# Altium schematic sheet USB Isolator.SchDoc: USB Isolator
size A4; SheetNumber: 1; SheetTotal: 1
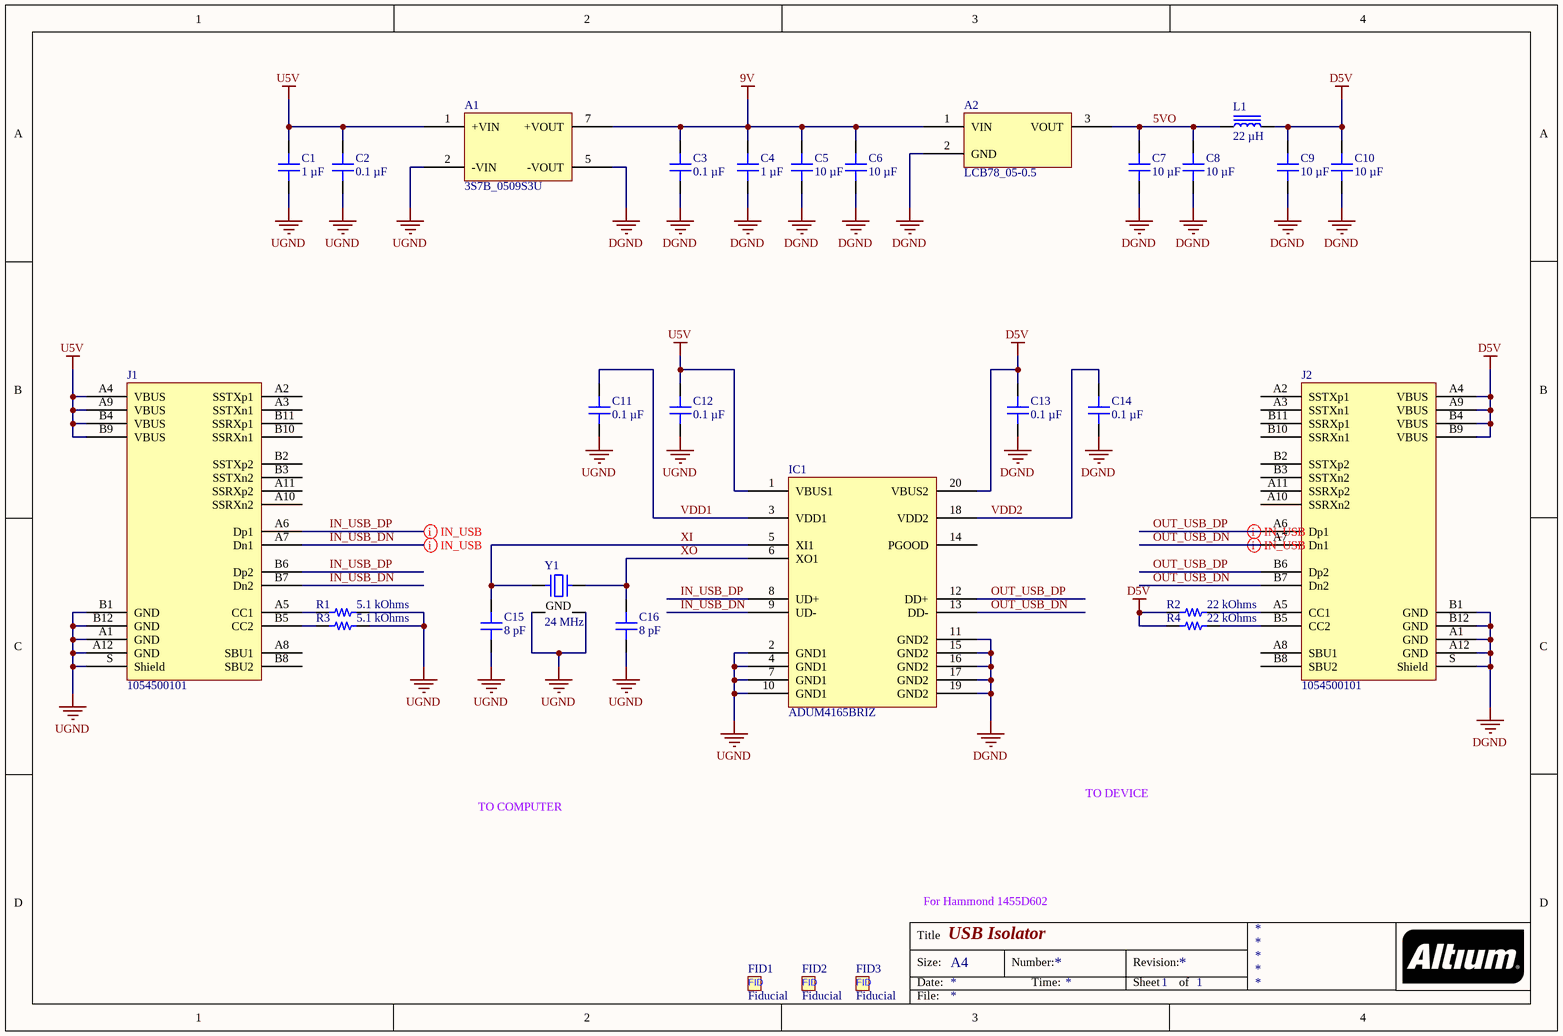
[diagram p0: USB Isolator.SchDoc]

## Parts
A1  3S7B_0509S3U  [GAPTEC 3S7B_3U SINGLE]
A2  LCB78_05-0.5  [GAPTEC LCB78_0.5]
C1  1 µF  [CAP 0603_1608]
C2  0.1 µF  [CAP 0603_1608]
C3  0.1 µF  [CAP 0603_1608]
C4  1 µF  [CAP 0603_1608]
C5  10 µF  [CAP 1206_3216 - 0.8MM]
C6  10 µF  [CAP 1206_3216 - 0.8MM]
C7  10 µF  [CAP 1206_3216 - 0.8MM]
C8  10 µF  [CAP 1206_3216 - 0.8MM]
C9  10 µF  [CAP 1206_3216 - 0.8MM]
C10  10 µF  [CAP 1206_3216 - 0.8MM]
C11  0.1 µF  [CAP 0603_1608]
C12  0.1 µF  [CAP 0603_1608]
C13  0.1 µF  [CAP 0603_1608]
C14  0.1 µF  [CAP 0603_1608]
C15  8 pF  [CAP 0603_1608]
C16  8 pF  [CAP 0603_1608]
FID1  Fiducial  [Fiducial-1mm]  (no BOM)
FID2  Fiducial  [Fiducial-1mm]  (no BOM)
FID3  Fiducial  [Fiducial-1mm]  (no BOM)
IC1  ADUM4165BRIZ  [ANALOG SOIC-20 RI-20-1]
J1  1054500101  [Molex 1054500101]
J2  1054500101  [Molex 1054500101]
L1  22 µH  [TDK VLCF4028-2]
R1  5.1 kOhms  [RES 0603_1608]
R2  22 kOhms  [RES 0603_1608]
R3  5.1 kOhms  [RES 0603_1608]
R4  22 kOhms  [RES 0603_1608]
Y1  24 MHz  [NDK NX2520SA]

## Nets
9V: A1.7(+VOUT) A2.1(VIN) C3.2 C4.2 C5.2 C6.2
D5V: C9.2 C10.2 C13.2 IC1.20(VBUS2) J2.A4(VBUS) J2.A9(VBUS) J2.B4(VBUS) J2.B9(VBUS) L1.2 R2.1 R4.1
DGND: A1.5(-VOUT) A2.2(GND) C3.1 C4.1 C5.1 C6.1 C7.1 C8.1 C9.1 C10.1 C13.1 C14.1 IC1.11(GND2) IC1.15(GND2) IC1.16(GND2) IC1.17(GND2) IC1.19(GND2) J2.A1(GND) J2.A12(GND) J2.B1(GND) J2.B12(GND) J2.S(Shield)
U5V: A1.1(+VIN) C1.2 C2.2 C12.2 IC1.1(VBUS1) J1.A4(VBUS) J1.A9(VBUS) J1.B4(VBUS) J1.B9(VBUS)
UGND: A1.2(-VIN) C1.1 C2.1 C11.1 C12.1 C15.1 C16.1 IC1.2(GND1) IC1.4(GND1) IC1.7(GND1) IC1.10(GND1) J1.A1(GND) J1.A12(GND) J1.B1(GND) J1.B12(GND) J1.S(Shield) R1.1 R3.1 Y1.2(GND) Y1.4(GND)
5VO: A2.3(VOUT) C7.2 C8.2 L1.1
IN_USB_DN: IC1.9(UD-) J1.A7(Dn1) J1.B7(Dn2)
IN_USB_DP: IC1.8(UD+) J1.A6(Dp1) J1.B6(Dp2)
OUT_USB_DN: IC1.13(DD-) J2.A7(Dn1) J2.B7(Dn2)
OUT_USB_DP: IC1.12(DD+) J2.A6(Dp1) J2.B6(Dp2)
VDD1: C11.2 IC1.3(VDD1)
VDD2: C14.2 IC1.18(VDD2)
XI: C15.2 IC1.5(XI1) Y1.1
XO: C16.2 IC1.6(XO1) Y1.3
NetJ1_A5: J1.A5(CC1) R1.2
NetJ1_B5: J1.B5(CC2) R3.2
NetJ2_A5: J2.A5(CC1) R2.2
NetJ2_B5: J2.B5(CC2) R4.2

Not connected (* = marked no-connect by the designer): IC1 14(PGOOD); J1 A2(SSTXp1) A3(SSTXn1) A8(SBU1) A10(SSRXn2) A11(SSRXp2) B2(SSTXp2) B3(SSTXn2) B8(SBU2) B10(SSRXn1) B11(SSRXp1); J2 A2(SSTXp1) A3(SSTXn1) A8(SBU1) A10(SSRXn2) A11(SSRXp2) B2(SSTXp2) B3(SSTXn2) B8(SBU2) B10(SSRXn1) B11(SSRXp1)

## Layout directives
differential pair; differential pair class USB: IN_USB_DN, IN_USB_DP, OUT_USB_DN, OUT_USB_DP

## Notes on the sheet
- TO COMPUTER
- TO DEVICE
- For Hammond 1455D602
- Title
- Size:
- Date:
- A4
- Number:
- Time:
- Revision:
- Sheet
- of
- File:
- (in symbol Fiducial) FID

## Library data of the parts
A1 = 3S7B_0509S3U: DC-DC; Manufacturer: GAPTEC Electronic; Current - Output (Max): 333mA; Efficiency: 84%; Number of Outputs: 1; Power (Watts): 3 W; Voltage - Input (Max): 5.5V; Voltage - Input (Min): 4.5V; Voltage - Isolation: 3 kV; Voltage - Output 1: 9V; Part Number: 3S7B_0509S3U; Applications: ITE (Commercial); ComponentLink1Description: Datasheet; ComponentLink1URL: https://gaptec-electronic.com/datenblaetter/3S7B_3U.pdf; ComponentLink2Description: DigiKey Link; ComponentLink2URL: https://www.digikey.com/en/products/detail/gaptec-electronic/3S7B-0509S3U/13692545; LastUpdated: 01/09/2023 20:51:51; Lifecycle Status: Active; Minimum Order: 1; Mounting Type: Through Hole; Operating Temperature: -40°C ~ 85°C; Packaging: Tube; PartId: 72; Part Status: Active; Price: 5.05; Series: 3S7B_3U (3W); Size / Dimension: 0.77" L x 0.28" W x 0.39" H (19.6mm x 7.0mm x 10.0mm); Supplier 1: DigiKey; Supplier Part Number 1: 3182-3S7B_0509S3U-ND; Type: Isolated Module
A2 = LCB78_05-0.5: DC-DC POL; Manufacturer: GAPTEC Electronic; Current - Output (Max): 500mA; Efficiency: 95%; Number of Outputs: 1; Power (Watts): 2.5 W; Voltage - Input (Max): 55V; Voltage - Input (Min): 6.5V; Voltage - Output 1: 5V; Part Number: LCB78_05-0.5; Applications: ITE (Commercial); ComponentLink1Description: Datasheet; ComponentLink1URL: https://gaptec-electronic.com/datenblaetter/LCB78_0.5.pdf; ComponentLink2Description: DigiKey Link; ComponentLink2URL: https://www.digikey.com/en/products/detail/gaptec-electronic/LCB78-05-0-5/13691990; LastUpdated: 04/09/2023 17:37:46; Lifecycle Status: Active; Minimum Order: 1; Mounting Type: Through Hole; Operating Temperature: -40°C ~ 85°C (With Derating); Packaging: Tube; PartId: 87; Part Status: Active; Price: 5.66; Series: LCB78_0.5; Size / Dimension: 0.46" L x 0.24" W x 0.40" H (11.6mm x 6.0mm x 10.2mm); Supplier 1: DigiKey; Supplier Part Number 1: 3182-LCB78_05-0.5-ND; Type: Non-Isolated PoL Module
C1 C4 = GCM188R71E105KA64D: CAP CER 1UF 25V X7R 0603; manufacturer: Murata Electronics; Tolerance: ±10%; Part Number: GCM188R71E105KA64D; Value: 1 µF; Applications: Automotive; Capacitance: 1 µF; componentlink1description: Datasheet; componentlink1url: https://www.murata.com/~/media/webrenewal/support/library/catalog/products/capacitor/mlcc/c03e.ashx?la=en-us; componentlink2description: DigiKey Link; componentlink2url: https://www.digikey.com/en/products/detail/murata-electronics/GCM188R71E105KA64D/4903956; Device Package: 0603 (1608 Metric); lastupdated: 20/08/2023 19:09:04; Lifecycle Status: Active; Minimum Order: 1; Mounting Type: Surface Mount, MLCC; Operating Temperature: -55°C ~ 125°C; Package / Case: 0603 (1608 Metric); packaging: TapeAndReel; partid: 6762; Part Status: Active; price: 0.03; Ratings: AEC-Q200; series: GCM; Size / Dimension: 0.063" L x 0.031" W (1.60mm x 0.80mm); Supplier 1: DigiKey; Supplier Part Number 1: 490-10673-1-ND; Temperature Coefficient: X7R; Thickness (Max): 0.035" (0.90mm); Voltage - Rated: 25V
C2 C3 C11-C14 = CL10B104KB8NNNC: CAP CER 0.1UF 50V X7R 0603; manufacturer: Samsung Electro-Mechanics; Tolerance: ±10%; Part Number: CL10B104KB8NNNC; Value: 0.1 µF; Applications: General Purpose; Capacitance: 0.1 µF; componentlink1description: Datasheet; componentlink1url: http://www.samsungsem.com/kr/support/product-search/mlcc/CL10B104KB8NNNC.jsp; componentlink2description: DigiKey Link; componentlink2url: https://www.digikey.com/en/products/detail/samsung-electro-mechanics/CL10B104KB8NNNC/3886658; Device Package: 0603 (1608 Metric); lastupdated: 20/08/2023 19:09:00; Lifecycle Status: Active; Minimum Order: 1; Mounting Type: Surface Mount, MLCC; Operating Temperature: -55°C ~ 125°C; Package / Case: 0603 (1608 Metric); packaging: TapeAndReel; partid: 9788; Part Status: Active; price: 0.01; series: CL; Size / Dimension: 0.063" L x 0.031" W (1.60mm x 0.80mm); Supplier 1: DigiKey; Supplier Part Number 1: 1276-1000-1-ND; Temperature Coefficient: X7R; Thickness (Max): 0.035" (0.90mm); Voltage - Rated: 50V
C5-C10 = CL31B106KAHNNNE: CAP CER 10UF 25V X7R 1206; manufacturer: Samsung Electro-Mechanics; Tolerance: ±10%; Part Number: CL31B106KAHNNNE; Value: 10 µF; Applications: General Purpose; Capacitance: 10 µF; componentlink1description: Datasheet; componentlink1url: http://www.samsungsem.com/kr/support/product-search/mlcc/CL31B106KAHNNNE.jsp; componentlink2description: DigiKey Link; componentlink2url: https://www.digikey.com/en/products/detail/samsung-electro-mechanics/CL31B106KAHNNNE/3887462; Device Package: 1206 (3216 Metric); lastupdated: 03/09/2023 19:14:37; Lifecycle Status: Active; Minimum Order: 1; Mounting Type: Surface Mount, MLCC; Operating Temperature: -55°C ~ 125°C; Package / Case: 1206 (3216 Metric); packaging: TapeAndReel; partid: 40754; Part Status: Active; price: 0.03; series: CL; Size / Dimension: 0.126" L x 0.063" W (3.20mm x 1.60mm); Supplier 1: DigiKey; Supplier Part Number 1: 1276-1804-1-ND; Temperature Coefficient: X7R; Thickness (Max): 0.071" (1.80mm); Voltage - Rated: 25V
C15 C16 = CGA3E2C0G1H080D080AA: CAP CER 8PF 50V C0G 0603; manufacturer: TDK Corporation; Temperature Coefficient: C0G, NP0; Tolerance: ±0.5pF; Part Number: CGA3E2C0G1H080D080AA; Value: 8 pF; Applications: Automotive; Capacitance: 8 pF; componentlink1description: Datasheet; componentlink1url: https://product.tdk.com/info/en/catalog/datasheets/mlcc_automotive_general_en.pdf?ref_disty=digikey; componentlink2description: DigiKey Link; componentlink2url: https://www.digikey.com/en/products/detail/tdk-corporation/CGA3E2C0G1H080D080AA/2443104; Device Package: 0603 (1608 Metric); lastupdated: 02/09/2023 19:08:31; Lifecycle Status: Active; Minimum Order: 1; Mounting Type: Surface Mount, MLCC; Operating Temperature: -55°C ~ 125°C; Package / Case: 0603 (1608 Metric); packaging: TapeAndReel; partid: 15270; Part Status: Active; price: 0.02; Ratings: AEC-Q200; series: CGA; Size / Dimension: 0.063" L x 0.031" W (1.60mm x 0.80mm); Supplier 1: DigiKey; Supplier Part Number 1: 445-5626-1-ND; Thickness (Max): 0.035" (0.90mm); Voltage - Rated: 50V
IC1 = ADUM4165BRIZ: 5KV 480MBPS USB DIG ISOLATOR HOS; Manufacturer: Analog Devices Inc.; Channel Type: Unidirectional; Common Mode Transient Immunity (Min): 40kV/µs; Inputs - Side 1/Side 2: 1/0; Isolated Power: Yes; Number of Channels: 1; Propagation Delay tpLH / tpHL (Max): 650ns, 600ns; Rise / Fall Time (Typ): 300ns, 350ns (Max); Voltage - Isolation: 5700Vrms; Voltage - Supply: 3V ~ 3.6V, 3V ~ 5.5V; Part Number: ADUM4165BRIZ; ComponentLink1Description: Datasheet; ComponentLink1URL: https://www.analog.com/media/en/technical-documentation/data-sheets/adum4165-4166.pdf; ComponentLink2Description: DigiKey Link; ComponentLink2URL: https://www.digikey.com/en/products/detail/analog-devices-inc/ADUM4165BRIZ/16285968; Data Rate: 480Mbps; LastUpdated: 01/09/2023 12:37:38; Lifecycle Status: Active; Minimum Order: 1; Mounting Type: Surface Mount; Operating Temperature: -55°C ~ 125°C; Packaging: Tube; PartId: 49; Price: 9.56; Series: -; Supplier 1: DigiKey; Supplier Part Number 1: 505-ADUM4165BRIZ-ND; Supplier Device Package: 20-SOIC-IC; Technology: Magnetic Coupling; Type: RS232, USB
J1 J2 = 1054500101: CONN RCP USB3.1 TYPEC 24P SMD RA; Manufacturer: Molex; Connector Type: USB - C (Type - C); Current Rating (Amps): 0.25A, 1A, 5A; Gender: Receptacle; Mating Cycles: 10000; Number of Contacts: 24; Number of Ports: 1; Shielding: Shielded; Specifications: USB 3.1 (USB 3.1 Gen 2, Superspeed+); Voltage - Rated: 30VAC/DC; Part Number: 1054500101; ComponentLink1Description: Datasheet; ComponentLink1URL: https://www.molex.com/pdm_docs/ps/PS-105448-001.pdf; ComponentLink2Description: DigiKey Link; ComponentLink2URL: http://digikey.com/product-detail/en/molex/1054500101/WM12856CT-ND/5843891; LastUpdated: 06/06/2020 02:14:04; Lifecycle Status: Active; Minimum Order: 1; Mounting Feature: Horizontal; Mounting Type: Surface Mount, Right Angle; Through Hole; Operating Temperature: -30°C ~ 85°C; Packaging: TapeAndReel; Part Status: Active; Price: 1.22; Series: 105445; Supplier 1: DigiKey; Supplier Part Number 1: WM12856CT-ND; Termination: Solder
L1 = VLCF5028T-220MR71-2: FIXED IND 22UH 710MA 140MOHM SMD; Manufacturer: TDK Corporation; DC Resistance (DCR): 140mOhm Max; Inductance Frequency - Test: 100 kHz; Material - Core: Ferrite; Shielding: Shielded; Tolerance: ±20%; Type: Drum Core, Wirewound; Part Number: VLCF5028T-220MR71-2; ComponentLink1Description: Datasheet; ComponentLink1URL: https://product.tdk.com/info/en/catalog/datasheets/inductor_commercial_power_vlcf5028-2_en.pdf?ref_disty=digikey; ComponentLink2Description: DigiKey Link; ComponentLink2URL: https://www.digikey.com/en/products/detail/tdk-corporation/VLCF5028T-220MR71-2/2465316; Current Rating (Amps): 710 mA; Current - Saturation: 710mA; Device Package: Nonstandard; Height - Seated (Max): 0.110" (2.80mm); Inductance: 22 µH; LastUpdated: 12/09/2023 20:23:17; Lifecycle Status: Active; Minimum Order: 1; Mounting Type: Surface Mount; Operating Temperature: -40°C ~ 105°C; Package / Case: Nonstandard; Packaging: TapeAndReel; PartId: 188; Part Status: Active; Price: 0.49; Series: VLCF; Size / Dimension: 0.197" L x 0.197" W (5.00mm x 5.00mm); Supplier 1: DigiKey; Supplier Part Number 1: 445-6559-1-ND; Value: 22 µH
R1 R3 = RK73H1JTTD5101F: RES 5.1K OHM 1% 1/10W 0603; Manufacturer: KOA Speer Electronics, Inc.; Power (Watts): 0.1W, 1/10W; Temperature Coefficient: ±100ppm/°C; Part Number: RK73H1JTTD5101F; Value: 5.1 kOhms; ComponentLink1Description: Datasheet; ComponentLink1URL: http://www.koaspeer.com/catimages/Products/RK73H/RK73H.pdf; ComponentLink2Description: DigiKey Link; ComponentLink2URL: https://www.digikey.com/en/products/detail/koa-speer-electronics-inc/RK73H1JTTD5101F/9844897; Composition: Thick Film; Device Package: 0603 (1608 Metric); Features: Automotive AEC-Q200, Moisture Resistant; Height - Seated (Max): 0.022" (0.55mm); LastUpdated: 01/09/2023 19:37:13; Lifecycle Status: Active; Minimum Order: 1; Number of Terminations: 2; Operating Temperature: -55°C ~ 155°C; Package / Case: 0603 (1608 Metric); Packaging: CutTape; PartId: 22947; Part Status: Active; Price: 0.01; Ratings: AEC-Q200; Resistance: 5.1 kOhms; Series: RK73H; Size / Dimension: 0.063" L x 0.031" W (1.60mm x 0.80mm); Supplier 1: DigiKey; Supplier Part Number 1: 2019-RK73H1JTTD5101FCT-ND; Supplier Device Package: 0603; Tolerance: ±1%
R2 R4 = RC0603FR-1322KL: RES 22K OHM 1% 1/10W 0603; Manufacturer: Yageo; Power (Watts): 0.1W, 1/10W; Temperature Coefficient: ±100ppm/°C; Part Number: RC0603FR-1322KL; Value: 22 kOhms; ComponentLink1Description: Datasheet; ComponentLink1URL: https://www.yageo.com/upload/media/product/productsearch/datasheet/rchip/PYu-RC_Group_51_RoHS_L_11.pdf; ComponentLink2Description: DigiKey Link; ComponentLink2URL: https://www.digikey.com/en/products/detail/yageo/RC0603FR-1322KL/13694068; Composition: Thick Film; Device Package: 0603 (1608 Metric); Features: Moisture Resistant; Height - Seated (Max): 0.022" (0.55mm); LastUpdated: 01/09/2023 19:36:07; Lifecycle Status: Active; Minimum Order: 1; Number of Terminations: 2; Operating Temperature: -55°C ~ 155°C; Package / Case: 0603 (1608 Metric); Packaging: CutTape; PartId: 65454; Part Status: Active; Price: 0.01; Resistance: 22 kOhms; Series: RC_L; Size / Dimension: 0.063" L x 0.031" W (1.60mm x 0.80mm); Supplier 1: DigiKey; Supplier Part Number 1: 13-RC0603FR-1322KLCT-ND; Supplier Device Package: 0603; Tolerance: ±1%
Y1 = NX2520SA-24MHZ-EXS00A-CS11339: CRYSTAL 24.0000MHZ 8PF SMD; Manufacturer: NDK America, Inc.; ESR (Equivalent Series Resistance): 60 Ohms; Frequency Stability: ±10ppm; Operating Mode: Fundamental; Part Number: NX2520SA-24MHZ-EXS00A-CS11339; ComponentLink1Description: Datasheet; ComponentLink1URL: //media.digikey.com/pdf/Data%20Sheets/NDK%20PDFs/NX2520SA-24MHz-EXS00A-CS11339.pdf; ComponentLink2Description: DigiKey Link; ComponentLink2URL: https://www.digikey.com/en/products/detail/ndk-america-inc/NX2520SA-24MHZ-EXS00A-CS11339/8275431; Frequency: 24 MHz; Frequency Tolerance: ±10ppm; Height - Seated (Max): 0.022" (0.55mm); LastUpdated: 01/09/2023 20:30:12; Lifecycle Status: Active; Load Capacitance: 8pF; Minimum Order: 1; Mounting Type: Surface Mount; Operating Temperature: -20°C ~ 70°C; Package / Case: 4-SMD, No Lead; Packaging: TapeAndReel; PartId: 520; Part Status: Active; Price: 0.71; Series: NX2520SA; Size / Dimension: 0.098" L x 0.079" W (2.50mm x 2.00mm); Supplier 1: DigiKey; Supplier Part Number 1: 644-1326-1-ND; Type: MHz Crystal; Value: 24 MHz